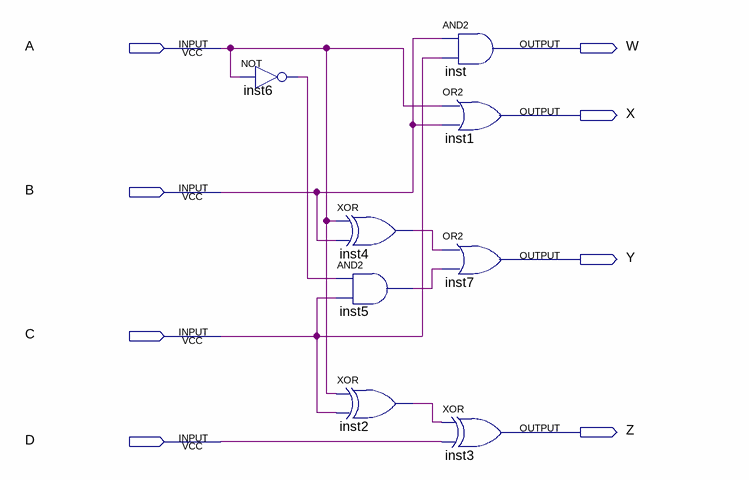
[diagram p0: schematic sheet]
// Quartus schematic Experiment32.bdf as structural Verilog: 8 symbols, 8 pins
module Experiment32 (
  input  A,
  input  B,
  input  C,
  input  D,
  output W,
  output X,
  output Y,
  output Z
);

  wire inst2_out, inst4_out, inst5_out, inst6_out;

  not inst6 (inst6_out, A);
  xor inst4 (inst4_out, A, B);
  and inst5 (inst5_out, inst6_out, C);
  xor inst2 (inst2_out, A, C);
  and inst (W, B, C);
  or inst1 (X, A, B);
  or inst7 (Y, inst4_out, inst5_out);
  xor inst3 (Z, inst2_out, D);
endmodule
